# Altium schematic sheet Bombas.SchDoc
size A4
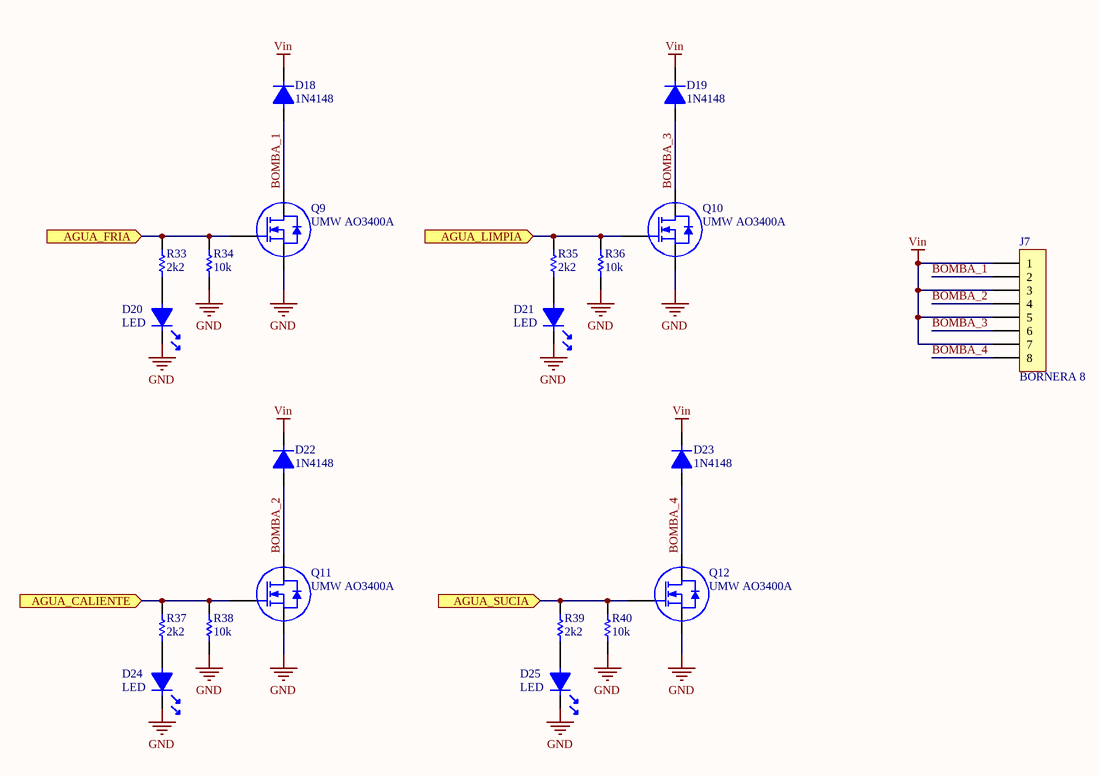
[diagram p0: Bombas.SchDoc]

## Parts
D18  1N4148  [1206K]
D19  1N4148  [1206K]
D20  LED  [LED0805]
D21  LED  [LED0805]
D22  1N4148  [1206K]
D23  1N4148  [1206K]
D24  LED  [LED0805]
D25  LED  [LED0805]
J7  BORNERA 8  [BORNERA8]
Q9  UMW AO3400A  [SOT23]
Q10  UMW AO3400A  [SOT23]
Q11  UMW AO3400A  [SOT23]
Q12  UMW AO3400A  [SOT23]
R33  2k2  [0805]
R34  10k  [0805]
R35  2k2  [0805]
R36  10k  [0805]
R37  2k2  [0805]
R38  10k  [0805]
R39  2k2  [0805]
R40  10k  [0805]

## Ports
AGUA_CALIENTE (in), AGUA_FRIA (in), AGUA_LIMPIA (in), AGUA_SUCIA (in)

## Nets
GND: D20.2 D21.2 D24.2 D25.2 Q9.3(S) Q10.3(S) Q11.3(S) Q12.3(S) R34.1 R36.1 R38.1 R40.1
Vin: D18.2 D19.2 D22.2 D23.2 J7.1 J7.3 J7.5 J7.7
AGUA_CALIENTE: Q11.1(G) R37.2 R38.2 ; port AGUA_CALIENTE
AGUA_FRIA: Q9.1(G) R33.2 R34.2 ; port AGUA_FRIA
AGUA_LIMPIA: Q10.1(G) R35.2 R36.2 ; port AGUA_LIMPIA
AGUA_SUCIA: Q12.1(G) R39.2 R40.2 ; port AGUA_SUCIA
BOMBA_1: D18.1 J7.2 Q9.2(D)
BOMBA_2: D22.1 J7.4 Q11.2(D)
BOMBA_3: D19.1 J7.6 Q10.2(D)
BOMBA_4: D23.1 J7.8 Q12.2(D)
NetD20_1: D20.1 R33.1
NetD21_1: D21.1 R35.1
NetD24_1: D24.1 R37.1
NetD25_1: D25.1 R39.1

## Library data of the parts
D18 D19 D22 D23 = DIODO
Q9-Q12 = MOSFET N
R33-R40 = RES